# Altium schematic sheet isolated_rs485.SchDoc: foxBMS BMS-Extension
size A3; DocumentNumber: 9; SheetNumber: 9; SheetTotal: 14; Author: Fraunhofer IISB foxBMS Team; REL-DATE: 2017-05-16; VERSION: 1.0.2; GateName_1: G$1; SymbolName_1: FRAME_B_L; LibraryName: foxBMS_BMS-Master_V1.00_A; DeviceSetName: FRAME_B_L; GateName_2: G$2; SymbolName_2: DOCFIELD; SheetDescription: Isolated RS485
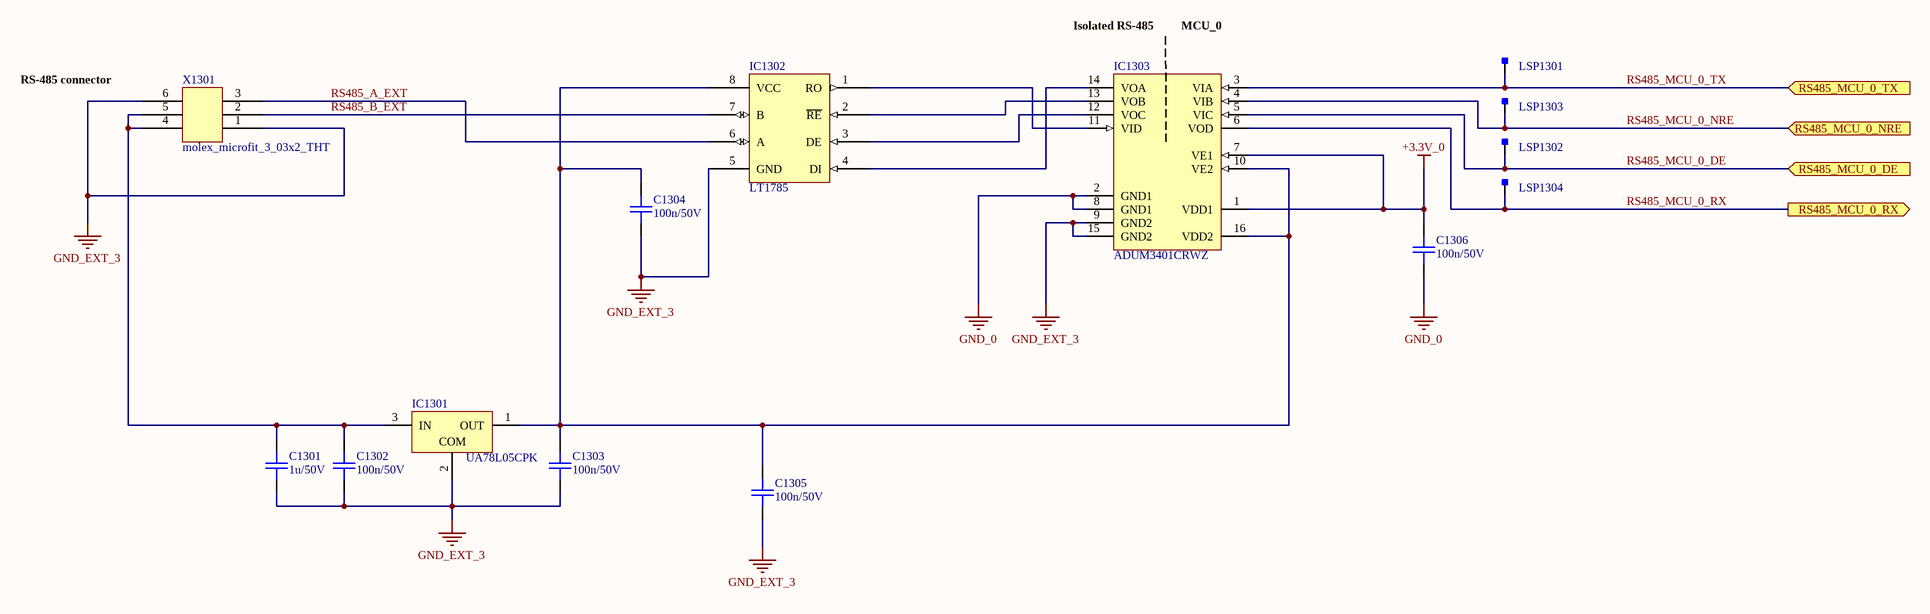
[diagram p0: isolated_rs485.SchDoc]

## Parts
C1301  1u/50V  [CAPC1608X08N]
C1302  100n/50V  [CAPC1608X08N]
C1303  100n/50V  [CAPC1608X08N]
C1304  100n/50V  [CAPC1608X08N]
C1305  100n/50V  [CAPC1608X08N]
C1306  100n/50V  [CAPC1608X08N]
IC1301  UA78L05CPK  [PK0003A_L]
IC1302  LT1785  [SOIC127P600X175-8N]
IC1303  ADUM3401CRWZ  [ADI-RW-16_N]
LSP1301  Testpoint_Square  [Testpoint_S1]  (value not drawn)  (no BOM)
LSP1302  Testpoint_Square  [Testpoint_S1]  (value not drawn)  (no BOM)
LSP1303  Testpoint_Square  [Testpoint_S1]  (value not drawn)  (no BOM)
LSP1304  Testpoint_Square  [Testpoint_S1]  (value not drawn)  (no BOM)
X1301  molex_microfit_3_03x2_THT  [MOLEX_MICROFIT_03x2_THT]

## Ports
RS485_MCU_0_DE (in), RS485_MCU_0_NRE (in), RS485_MCU_0_RX (out), RS485_MCU_0_TX (in)

## Nets
+3.3V_0: C1306.1 IC1303.1(VDD1) IC1303.7(VE1)
GND_0: C1306.2 IC1303.2(GND1) IC1303.8(GND1)
GND_EXT_3: C1301.2 C1302.2 C1303.2 C1304.2 C1305.2 IC1301.2(COM) IC1302.5(GND) IC1303.9(GND2) IC1303.15(GND2) X1301.1 X1301.6
RS485_A_EXT: IC1302.6(A) X1301.3
RS485_B_EXT: IC1302.7(B) X1301.2
RS485_MCU_0_DE: IC1303.5(VIC) LSP1302.1 ; port RS485_MCU_0_DE
RS485_MCU_0_NRE: IC1303.4(VIB) LSP1303.1 ; port RS485_MCU_0_NRE
RS485_MCU_0_RX: IC1303.6(VOD) LSP1304.1 ; port RS485_MCU_0_RX
RS485_MCU_0_TX: IC1303.3(VIA) LSP1301.1 ; port RS485_MCU_0_TX
NetC1301_1: C1301.1 C1302.1 IC1301.3(IN) X1301.4 X1301.5
NetC1303_1: C1303.1 C1304.1 C1305.1 IC1301.1(OUT) IC1302.8(VCC) IC1303.10(VE2) IC1303.16(VDD2)
NetIC1302_1: IC1302.1(RO) IC1303.11(VID)
NetIC1302_2: IC1302.2(~{RE}) IC1303.13(VOB)
NetIC1302_3: IC1302.3(DE) IC1303.12(VOC)
NetIC1302_4: IC1302.4(DI) IC1303.14(VOA)

## Notes on the sheet
- Isolated RS-485
- MCU_0
- RS-485 connector
- Fraunhofer IISB
- Schottkystr. 10
- developed by:
- 91058 Erlangen
- Germany
- Author
- Project
- License
- Description
- File
- Version
- Release Date
- Sheet
- www.foxbms.org
- www.iisb.fraunhofer.de
- foxBMS Team
- /

## Library data of the parts
C1301 = gen_C_ceramic_1u_50V_X7R_0603: MLCC; Capacitance: 1u; Rated Voltage: 50V; Dielectric: X7R; Tolerance: ± 10%; Case EIA: 0603; Case Metric: 1608; Part Number: gen_C_ceramic_1u_50V_X7R_0603; Operating Temperature: -55°C - +125°C; Supplier 1: Farnell; Supplier Part Number 1: 2779055
C1302-C1306 = gen_C_ceramic_100n_50V_X7R_0603: MLCC; Capacitance: 100n; Rated Voltage: 50V; Dielectric: X7R; Case EIA: 0603; Case Metric: 1608; PnP Package: C_0603_10; PnP Value: 100n/50V/X7R; PnP equipped: x; Part Number: gen_C_ceramic_100n_50V_X7R_0603; Supplier 1: Farnell; Supplier Part Number 1: 2525267
IC1301 = CMP-2000-07341-1: Positive-Voltage Regulator, 100 mA, 0 to 125 degC, 3-Pin SOT-89 (PK), Green (RoHS & no Sb/Br), Tape and Reel; Manufacturer: TexasInstruments; Load Regulation: 60mV; Input Voltage MIN: 7V; Number of Outputs: 1; Input Voltage MAX: 20V; Output Type: Fixed; Output Current: 100mA; Output Voltage: 5V; PSRR / Ripple Rejection - Typ: 49dB; Line Regulation: 200mV; Mounting Style: SMD/SMT; Datasheet Version: Rev. U, 05/2011; Polarity: Positive; Minimum Operating Temperature: 0C; Package Reference: PK0003A; Brand: TexasInstruments; Packaging: Reel; Product Category: LinearVoltageRegulators; RoHS: True; Datasheet URL: http://www.ti.com/lit/ds/symlink/ua78l05.pdf; Package URL: http://www.ti.com/lit/ml/mhsi001b/mhsi001b.pdf; Series: UA78L05; Manufacturer URL: http://www.ti.com/; Package Description: 3-Pin Small Outline Transistor, Body 4.5 x 2.5 mm, Pitch 1.5 mm; Mounting Technology: SurfaceMount; Package / Case: SOT-89-4; Maximum Operating Temperature: +125C
IC1302 = LT1785CS8#PBF: Transceiver RS422/RS485, Fault Protected, 4.75V-5.25V supply, SOIC-8; Manufacturer: Linear Technology; Part Number: LT1785CS8#PBF; Part Name: LT1785CS8; Operating Temperature: 0°C - 70°C; ComponentLink1Description: Datasheet; ComponentLink1URL: http://www.farnell.com/datasheets/1905888.pdf; Supplier 1: Farnell; Supplier Part Number 1: 1663498
IC1303 = CMP-0534-00405-1: Quad Channel Digital Isolator, Enhanced System-Level ESD Reliability, 2.5 KV rms Insulation Rating, 90 Mbps Data Rate, 32 ns Delay, Industrial, 16-pin SOIC (RW-16), Tube; Manufacturer: Analog Devices; Insulation Rating (kVrms): 2.5; Max Data Rate: 90Mbps; PackageDescription: 16-Pin Standard Small Outline Package, Body 10.3 x 7.5 mm, Pitch 1.27 mm; ComponentLink2Description: Datasheet; Mounting Technology: Surface Mount; ComponentLink2URL: http://www.analog.com/static/imported-files/data_sheets/ADUM3400_3401_3402.pdf; ComponentLink4URL: Product URL:http://www.analog.com/en/interface-isolation/digital-isolators/adum3401/products/product.html; ComponentLink1URL: http://www.analog.com/en/index.html; ComponentLink1Description: Manufacturer URL; Max Operating Temp (degreesC): 105; PartNumber: ADUM3401CRWZ; Code_JEDEC: MS-013-AA; PackageVersion: 032707-B, 03/2007; ComponentLink3URL: http://www.analog.com/static/imported-files/packages/PKG_PDF/SOIC_WIDE%20%28RW%29/RW_16.pdf; DatasheetVersion: Rev. B; PackageReference: RW-16; ComponentLink4Description: URL Link1; ComponentLink3Description: Package Specification
LSP1301-LSP1304 = Testpoint_Square: Testpoint, square; Part Number: Testpoint_Square
X1301 = molex_microfit_3_03x2_THT: Micro-Fit 3.0 Right Angle Header, 3.00mm Pitch, Dual Row, 6 Circuits, with Snap-in Plastic Peg PCB Lock, Tin, Glow Wire Capable, Black, 43045-0600; Manufacturer: Molex; Circuits: 6; Rated Voltage: 600V; Rated Current: 8.5A; Part Number: molex_microfit_3_03x2_THT; Part Name: MicroFit; Operating Temperature: -40°C - +105°C; Supplier 1: Farnell; Supplier Part Number 1: 1012252